# EAGLE design RoboCore Light sensor bar (EAGLE 9.6.2)
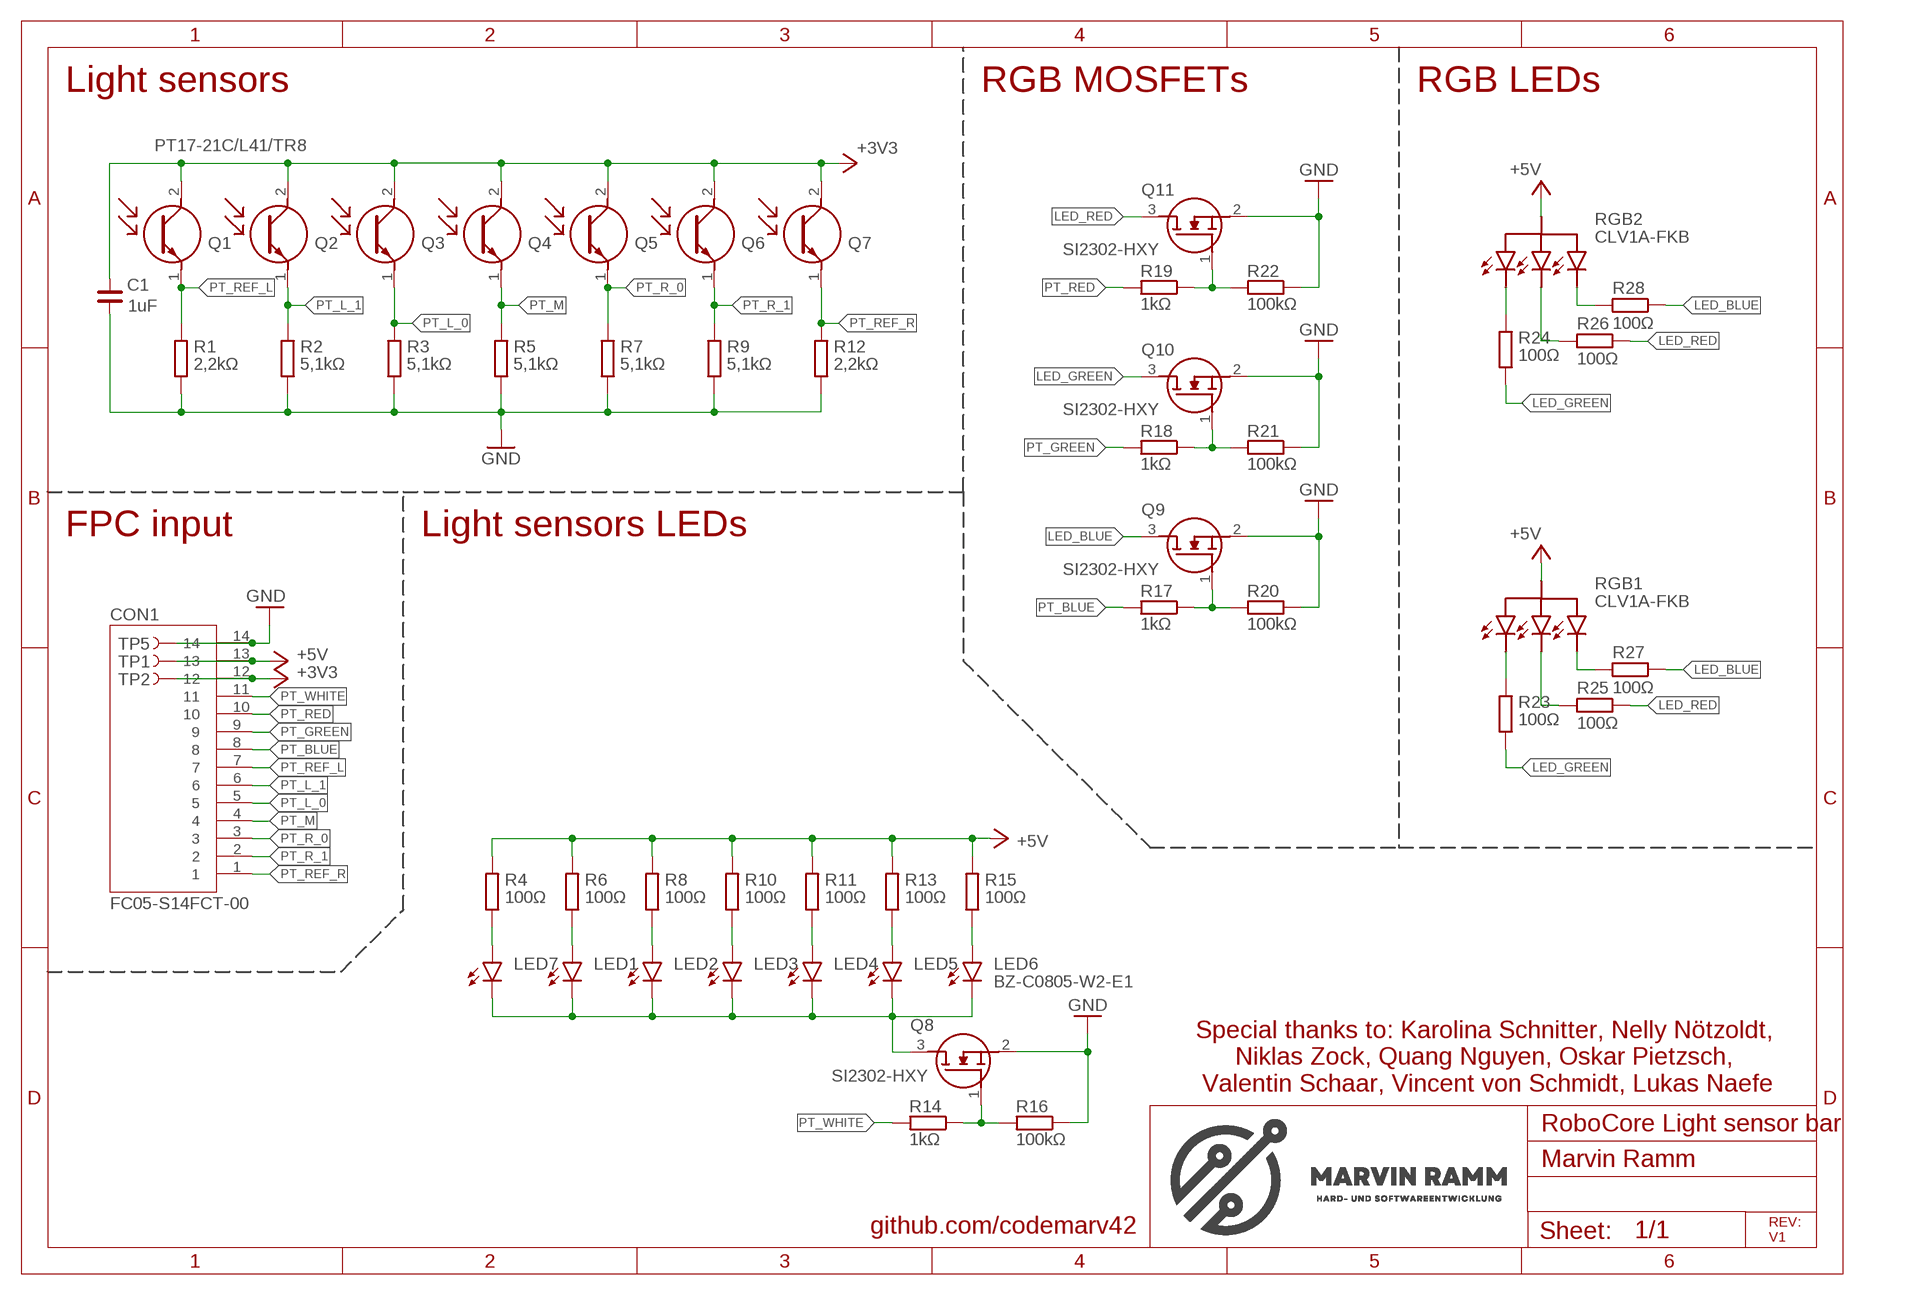
[diagram p0: schematic, sheet 1]

## Parts
C1  1uF  C_0402  [C0402]
CON1  FC05-S14FCT-00  [FC05-S14FCT-00]
LED1  LEDCHIP-LED0805  [CHIP-LED0805]
LED2  LEDCHIP-LED0805  [CHIP-LED0805]
LED3  LEDCHIP-LED0805  [CHIP-LED0805]
LED4  LEDCHIP-LED0805  [CHIP-LED0805]
LED5  LEDCHIP-LED0805  [CHIP-LED0805]
LED6  LEDCHIP-LED0805  [CHIP-LED0805]
LED7  LEDCHIP-LED0805  [CHIP-LED0805]
Q1  PT17-21C/L41/TR8  [0805]
Q2  PT17-21C/L41/TR8  [0805]
Q3  PT17-21C/L41/TR8  [0805]
Q4  PT17-21C/L41/TR8  [0805]
Q5  PT17-21C/L41/TR8  [0805]
Q6  PT17-21C/L41/TR8  [0805]
Q7  PT17-21C/L41/TR8  [0805]
Q8  SI2302DDS-T1-GE3  [SOT95P237X112-3N]
Q9  SI2302DDS-T1-GE3  [SOT95P237X112-3N]
Q10  SI2302DDS-T1-GE3  [SOT95P237X112-3N]
Q11  SI2302DDS-T1-GE3  [SOT95P237X112-3N]
R1  2,2kΩ  R_0402  [R0402]
R2  5,1kΩ  R_0402  [R0402]
R3  5,1kΩ  R_0402  [R0402]
R4  100Ω  R_0402  [R0402]
R5  5,1kΩ  R_0402  [R0402]
R6  100Ω  R_0402  [R0402]
R7  5,1kΩ  R_0402  [R0402]
R8  100Ω  R_0402  [R0402]
R9  5,1kΩ  R_0402  [R0402]
R10  100Ω  R_0402  [R0402]
R11  100Ω  R_0402  [R0402]
R12  2,2kΩ  R_0402  [R0402]
R13  100Ω  R_0402  [R0402]
R14  1kΩ  R_0402  [R0402]
R15  100Ω  R_0402  [R0402]
R16  100kΩ  R_0402  [R0402]
R17  1kΩ  R_0402  [R0402]
R18  1kΩ  R_0402  [R0402]
R19  1kΩ  R_0402  [R0402]
R20  100kΩ  R_0402  [R0402]
R21  100kΩ  R_0402  [R0402]
R22  100kΩ  R_0402  [R0402]
R23  100Ω  R_0402  [R0402]
R24  100Ω  R_0402  [R0402]
R25  100Ω  R_0402  [R0402]
R26  100Ω  R_0402  [R0402]
R27  100Ω  R_0402  [R0402]
R28  100Ω  R_0402  [R0402]
RGB1  RGBLED  [RGBLED]
RGB2  RGBLED  [RGBLED]
TP1  TEST-POINT3X5  [PAD.03X.05]
TP2  TEST-POINT3X5  [PAD.03X.05]
TP5  TEST-POINT3X5  [PAD.03X.05]

## Nets
+3V3: C1.2 CON1.12 Q1.2(C) Q2.2(C) Q3.2(C) Q4.2(C) Q5.2(C) Q6.2(C) Q7.2(C) TP2.1
+5V: CON1.13 R4.1 R6.1 R8.1 R10.1 R11.1 R13.1 R15.1 RGB1.+5V RGB2.+5V TP1.1
GND: C1.1 CON1.14 Q8.2(S) Q9.2(S) Q10.2(S) Q11.2(S) R1.2 R2.2 R3.2 R5.2 R7.2 R9.2 R12.2 R16.2 R20.2 R21.2 R22.2 TP5.1
LED_BLUE: Q9.3(D) R27.2 R28.2
LED_GREEN: Q10.3(D) R23.2 R24.2
LED_RED: Q11.3(D) R25.2 R26.2
N$1: LED1.C LED2.C LED3.C LED4.C LED5.C LED6.C LED7.C Q8.3(D)
N$2: LED7.A R4.2
N$3: Q11.1(G) R19.2 R22.1
N$4: Q10.1(G) R18.2 R21.1
N$5: Q9.1(G) R17.2 R20.1
N$14: LED5.A R13.2
N$15: LED6.A R15.2
N$17: Q8.1(G) R14.2 R16.1
N$18: LED4.A R11.2
N$45: R24.1 RGB2.P3
N$46: R28.1 RGB2.P1
N$47: R26.1 RGB2.P2
N$50: R23.1 RGB1.P3
N$51: R27.1 RGB1.P1
N$52: R25.1 RGB1.P2
N$53: LED3.A R10.2
N$54: LED2.A R8.2
N$55: LED1.A R6.2
PT_BLUE: CON1.8 R17.1
PT_GREEN: CON1.9 R18.1
PT_L_0: CON1.5 Q3.1(E) R3.1
PT_L_1: CON1.6 Q2.1(E) R2.1
PT_M: CON1.4 Q4.1(E) R5.1
PT_R_0: CON1.3 Q5.1(E) R7.1
PT_R_1: CON1.2 Q6.1(E) R9.1
PT_RED: CON1.10 R19.1
PT_REF_L: CON1.7 Q1.1(E) R1.1
PT_REF_R: CON1.1 Q7.1(E) R12.1
PT_WHITE: CON1.11 R14.1

## Notes on the sheet
- Light sensors | RGB MOSFETs | RGB LEDs
- RGB2
- SI2302-HXY | CLV1A-FKB
- SI2302-HXY
- FPC input | Light sensors LEDs
- SI2302-HXY
- RGB1
- CLV1A-FKB
- BZ-C0805-W2-E1
- Special thanks to: Karolina Schnitter, Nelly Nötzoldt, 
  Niklas Zock, Quang Nguyen, Oskar Pietzsch, 
  Valentin Schaar, Vincent von Schmidt, Lukas Naefe
- SI2302-HXY
- Marvin Ramm
- github.com/codemarv42
- REV:
  V1

## Library data of the parts
C1 = rc-master-smd:C_: NON-POLARIZED CAP
CON1 = FC05-S14FCT-00:FC05-S14FCT-00
LED1-LED7 = Led:LED: LED OSRAM: - CHIPLED LG R971, LG N971, LY N971, LG Q971, LY Q971, LO R971, LY R971 LH N974, LH R974 LS Q976, LO Q976, LY Q976 LO Q996 - Hyper CHIPLED LW Q18S LB Q993, LB Q99A, LB R99A - SideLED LS A670, LO A670, LY A670, LG A670, LP A670 LB A673, LV A673, LT A673, LW A673 LH A674 LY A675 LS A676, LA A676, LO A676, LY A676, LW A676 LS A679, LY A679, LG A679 - Hyper Micro SIDELED® LS Y876, LA Y876, LO Y876, LY Y876 LT Y87S - SmartLED LW L88C, LW L88S LB L89C, LB L89S, LG L890 LS L89K, LO L89K, LY L89K LS L896, LA L896, LO L896, LY L896 - TOPLED LS T670, LO T670, LY T670, LG T670, LP T670 LSG T670, LSP T670, LSY T670, LOP T670, LYG T670 LG T671, LOG T671, LSG T671 LB T673, LV T673, LT T673, LW T673 LH T674 LS T676, LA T676, LO T676, LY T676, LB T676, LH T676, LSB T676, LW T676 LB T67C, LV T67C, LT T67C, LS T67K, LO T67K, LY T67K, LW E67C LS E67B, LA E67B, LO E67B, LY E67B, LB E67C, LV E67C, LT E67C LW T67C LS T679, LY T679, LG T679 LS T770, LO T770, LY T770, LG T770, LP T770 LB T773, LV T773, LT T773, LW T773 LH T774 LS E675, LA E675, LY E675, LS T675 LS T776, LA T776, LO T776, LY T776, LB T776 LHGB T686 LT T68C, LB T68C - Hyper Mini TOPLED® LB M676 - Mini TOPLED Santana® LG M470 LS M47K, LO M47K, LY M47K Source: http://www.osram.convergy.de LUXEON: - LUMILED® LXK2-PW12-R00, LXK2-PW12-S00, LXK2-PW14-U00, LXK2-PW14-V00 LXK2-PM12-R00, LXK2-PM12-S00, LXK2-PM14-U00 LXK2-PE12-Q00, LXK2-PE12-R00, LXK2-PE12-S00, LXK2-PE14-T00, LXK2-PE14-U00 LXK2-PB12-K00, LXK2-PB12-L00, LXK2-PB12-M00, LXK2-PB14-N00, LXK2-PB14-P00, LXK2-PB14-Q00 LXK2-PR12-L00, LXK2-PR12-M00, LXK2-PR14-Q00, LXK2-PR14-R00 LXK2-PD12-Q00, LXK2-PD12-R00, LXK2-PD12-S00 LXK2-PH12-R00, LXK2-PH12-S00 LXK2-PL12-P00, LXK2-PL12-Q00, LXK2-PL12-R00 Source: www.luxeon.com KINGBRIGHT: KA-3528ASYC Source: www.kingbright.com
Q1-Q7 = Eigene Library:PT17-21C/L41/TR8
Q8-Q11 = SI2302DDS-T1-GE3:SI2302DDS-T1-GE3: SI2302DDS-T1-GE3 N-Channel MOSFET, 2.6 A, 20 V, 3-Pin SOT-363 Vishay Source: Datasheet <http://www.vishay.com/docs/63653/si2302dds.pdf>; ARROW_PART_NUMBER: SI2302DDS-T1-GE3; ARROW_PRICE-STOCK: https://www.arrow.com/en/products/si2302dds-t1-ge3/vishay; DESCRIPTION: SI2302DDS-T1-GE3 N-Channel MOSFET, 2.6 A, 20 V, 3-Pin SOT-363 Vishay; HEIGHT: 1.12mm; MANUFACTURER_NAME: Vishay; MANUFACTURER_PART_NUMBER: SI2302DDS-T1-GE3; MOUSER_PART_NUMBER: 78-SI2302DDS-T1-GE3; MOUSER_PRICE-STOCK: https://www.mouser.co.uk/ProductDetail/Vishay-Semiconductors/SI2302DDS-T1-GE3?qs=MxnWX8BLHKdaCSNWhg%252BxLA%3D%3D
R1-R28 = rc-master-smd:R_: RESISTOR
RGB1 RGB2 = RGB LED:RGBLED
TP1 TP2 TP5 = SparkFun-Connectors:TEST-POINT: SparkFun Test Points Bare copper test points for troubleshooting or In-Circuit-Testing. These are used by our Production team for verifying production board runs using pogo-pins on test beds. SparkFun Products: SparkFun LSM9DS1 Breakout <https://www.sparkfun.com/products/13284> SparkFun PSOC <https://www.sparkfun.com/products/13714> SparkFun Load Cell Amplifier <https://www.sparkfun.com/products/13879>

## Board
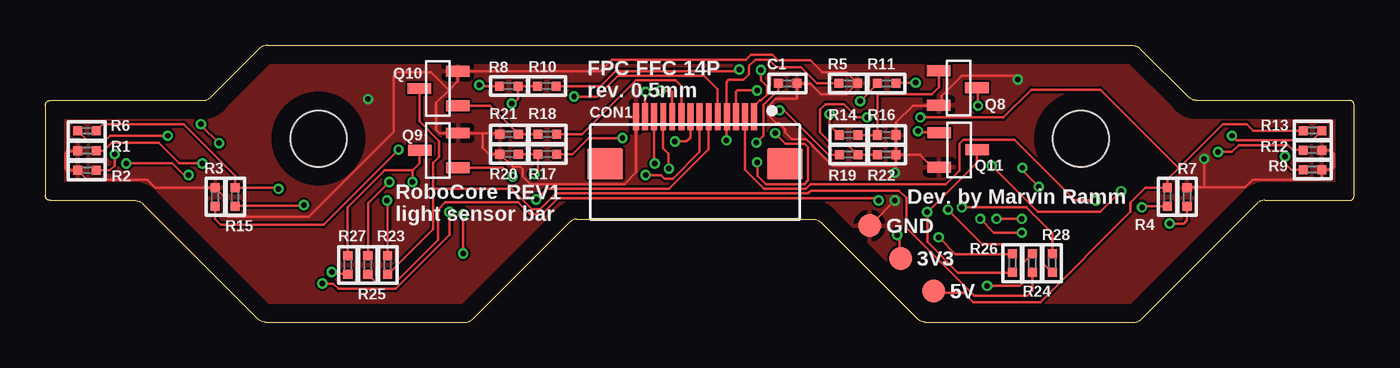
[diagram p1: board, top side]
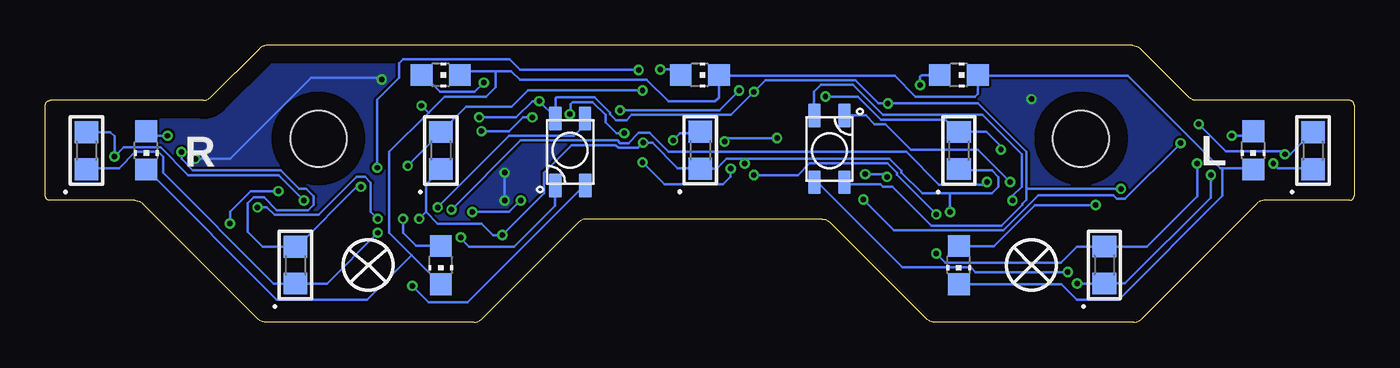
[diagram p2: board, bottom side, seen from below]

Size 72 x 15.23 mm. Coordinates in mm from the lower left corner, seen from the top.
Outline: 72,6.95 72,11.95 arc90 71.75,12.2 63.33,12.2 arc-45 62.9,12.38 60.23,15.05 arc45 59.8,15.23 12.2,15.23 arc37 11.82,15.1 9.1,12.38 arc-45 8.68,12.2 0.25,12.2 arc90 0,11.95 0,6.95 arc90 0.25,6.7 4.92,6.7 arc-45 5.35,6.52 11.7,0.17 arc45 12.12,0 23.07,0 arc45 23.5,0.17 28.82,5.5 arc-45 29.25,5.67 42.25,5.67 arc-45 42.67,5.5 48,0.17 arc45 48.42,0 59.88,0 arc45 60.3,0.17 66.65,6.52 arc-45 67.08,6.7 71.75,6.7 arc90 72,6.95
Copper layers (1*16): Top 0.035mm / dielectric 1.53mm / Bottom 0.035mm
Design rules "JLCPCB_1-2layer": minimum track width 5mil, minimum drill 0.3mm, track to track 5mil, track to pad 0.2mm, pad to pad 7mil, via to via 7mil, smd to smd 7mil, copper to edge 40mil, drill to drill 6mil, minimum pad ring 6mil, minimum via ring 0.13mm, stop-mask expansion 0.1mm, vias tented up to drill 20mil, thermal gap 10mil
Holes 3.1 mm at 15.03,10.1 56.98,10.1

### Footprints (pad centres in the part's own frame; a part is rotated, then mirrored left to right if it is on the bottom)
C0402 = smd 0.5 x 0.5: 1 -0.508,0; 2 0.508,0
FC05-S14FCT-00 = smd 0.32 x 1.5: 1 2.51,-0.45; 2 3.01,-0.45; 3 3.51,-0.45; 4 4.01,-0.45; 5 4.51,-0.45; 6 5.01,-0.45; 7 5.51,-0.45; 8 6.01,-0.45; 9 6.51,-0.45; 10 7.01,-0.45; 11 7.51,-0.45; 12 8.01,-0.45; 13 8.51,-0.45; 14 9.01,-0.45 | smd 2 x 1.7: PAD1 0.81,2.15; PAD2 10.71,2.15
CHIP-LED0805 = smd 1.2 x 1.2: A 0,-1.05; C 0,1.05
0805 = smd 1.2 x 1.3: 1 -1.016,0; 2 1.016,0
SOT95P237X112-3N = smd 1.3 x 0.6: 1 -1.05,0.95; 2 -1.05,-0.95; 3 1.05,0
R0402 = smd 0.5 x 0.5: 1 -0.508,0; 2 0.508,0
RGBLED = smd 0.686 x 1.3: +5V -1.456,1.996; P1 0.184,1.996; P2 -1.458,-1.678; P3 0.192,-1.678
PAD.03X.05 = smd 1.27 x 1.27: 1 0,0

### Placement (x,y rotation side)
C1  40.83,13.14 180 top
CON1  41.5,10.86 180 top
LED1  5.55,9.45 180 bottom
LED2  21.75,13.6 270 bottom
LED3  36,13.6 270 bottom
LED4  50.25,13.6 270 bottom
LED5  66.45,9.45 180 bottom
LED6  21.75,3.15 180 bottom
LED7  50.25,3.15 180 bottom
Q1  13.74,3.15 270 bottom
Q2  2.27,9.44 270 bottom
Q3  21.75,9.45 270 bottom
Q4  35.97,9.46 270 bottom
Q5  50.24,9.45 270 bottom
Q6  69.75,9.44 270 bottom
Q7  58.24,3.14 270 bottom
Q8  50.2,12.89 0 top
Q9  21.64,9.46 180 top
Q10  21.63,12.86 180 top
Q11  50.22,9.48 0 top
R1  2.28,9.44 180 top
R2  2.28,8.36 180 top
R3  9.34,6.9 90 top
R4  61.73,6.9 270 top
R5  44.16,13.14 0 top
R6  2.28,10.53 180 top
R7  62.81,6.9 90 top
R8  25.5,12.99 180 top
R9  69.72,8.4 0 top
R10  27.59,12.99 0 top
R11  46.28,13.14 0 top
R12  69.72,9.47 0 top
R13  69.72,10.54 0 top
R14  44.19,10.3 0 top
R15  10.44,6.9 270 top
R16  46.29,10.3 0 top
R17  27.62,9.25 180 top
R18  27.62,10.34 180 top
R19  44.19,9.22 0 top
R20  25.51,9.25 180 top
R21  25.51,10.34 180 top
R22  46.29,9.22 0 top
R23  18.83,3.15 270 top
R24  54.29,3.25 270 top
R25  17.74,3.15 270 top
R26  53.2,3.25 270 top
R27  16.64,3.15 90 top
R28  55.39,3.25 270 top
RGB1  29.5,9.7 180 bottom
RGB2  42.49,9.2 0 bottom
TP1  48.86,1.71 315 top
TP2  47.06,3.51 315 top
TP5  45.35,5.32 135 top

### Tracks (layer width: path | path; a pad name or v marks a point on that pad's centre or on a via)
+3V3  (via drill 0.3)
  Top 0.127: v4.45,8.73 6.99,8.73 7.62,8.1 v7.87,8.1 | v46.86,4.8 46.99,4.67 46.99,3.53 TP2.1 | v39.12,9.88 39.5,10.26 39.5,11.97 40.32,12.79 C1.2 | v33.53,8.73 33.49,8.77 CON1.12 | v15.24,2.13 15.84,2.13 16.13,1.83 19.25,1.83 22.23,4.8 v22.23,6.06 | v53.72,4.92 52.2,4.92 v51.44,5.69
  Bottom 0.127: Q6.2 69.72,8.48 67.94,8.48 67.06,9.37 65.79,9.37 65.53,9.11 65.53,8.23 59.44,2.13 58.29,2.13 Q7.2 58.17,2.13 56.52,2.13 v53.72,4.92 | v4.45,8.73 4.19,8.48 2.29,8.48 Q2.2 | v7.87,8.1 7.87,6.86 12.6,2.13 Q1.2 13.84,2.13 v15.24,2.13 | 51.05,6.07 50.42,5.43 48.01,5.43 47.37,4.8 v46.86,4.8 44.58,7.08 44.58,8.23 43.05,9.75 40.63,9.75 40.48,9.6 39.39,9.6 v39.12,9.88 38.61,9.88 37.21,8.48 36.01,8.48 Q4.2 35.09,8.44 34.54,8.99 34.08,8.99 34.07,8.99 33.53,8.99 | 51.05,6.07 51.05,7.59 50.29,8.35 Q5.2 | 22.23,7.08 23.75,7.08 24.9,8.24 24.9,8.33 25.56,8.99 33.53,8.99 | 22.23,7.08 19.94,7.08 19.56,7.46 19.56,7.97 19.94,8.35 21.72,8.35 Q3.2 | 33.53,8.99 v33.53,8.73 | 22.23,7.08 v22.23,6.06 | 51.05,6.07 v51.44,5.69
+5V  (via drill 0.3)
  Top 0.127: 62.36,8.48 64.77,10.89 66.1,10.89 66.45,10.54 R13.1 | 62.36,8.48 61.74,7.86 R4.1 60.52,7.41 59.69,6.58 59.69,6.07 54.74,1.11 51.05,1.11 50.55,1.62 48.9,1.62 TP1.1 | R6.1 3.15,10.89 7.61,10.89 10.44,8.05 R15.1 10.46,7.4 12.77,7.4 v12.83,7.34 | R10.1 R8.1 26.01,12.29 25.75,12.04 v25.65,12.04 | v44.83,12.16 45.72,13.05 R11.1 | v33.02,12.67 33,12.65 33,11.34 CON1.13 | 62.36,8.48 58.04,12.8 54.24,12.8 52.71,11.27 v48.13,11.27
  Bottom 0.127: 43.94,11.27 v44.83,12.16 45.21,12.16 46.1,11.27 v48.13,11.27 | 43.94,11.27 RGB2.+5V | 18.03,7.34 18.03,9.37 20.7,12.04 v25.65,12.04 26.16,12.04 27.43,13.31 32.38,13.31 v33.02,12.67 34.29,11.4 39.75,11.4 40.04,11.11 40.61,11.11 40.93,11.43 40.93,11.51 41.79,12.37 43.89,12.37 43.94,12.32 43.94,11.28 43.94,11.27 | RGB1.+5V 27.94,7.59 26.06,7.59 25.93,7.46 25.39,7.46 23.25,5.32 19.41,5.32 18.25,6.48 18.25,6.51 18.03,6.73 18.03,7.34 | 18.03,7.34 v12.83,7.34
GND  (via drill 0.3)
  Top 0.127: 63.75,7.41 65.99,7.41 66.42,7.84 70.11,7.84 70.23,7.97 R9.2 70.77,8.4 70.92,8.55 70.92,9.28 70.73,9.47 R12.2 70.23,9.37 | 63.75,7.41 R7.2 | R5.2 44.58,13.05 44.07,12.54 42.67,12.54 42.08,13.13 C1.1 41.34,12.32 41.32,12.29 40.18,12.29 39.75,11.86 39.75,11.4 40.21,10.94 40.38,10.94 40.69,10.62 40.69,10.46 41.08,10.08 41.85,10.08 42.21,9.73 42.21,9.71 43.31,8.61 46.8,8.61 | R22.2 R16.2 46.8,10.99 47.72,11.91 49.15,11.91 Q8.2 49.34,12.08 49.34,12.47 50.43,13.56 53.29,13.56 v53.5,13.35 | Q11.2 48.8,8.53 48.11,9.21 R22.2 | v46.74,6.7 45.47,5.43 TP5.1 | 46.8,8.61 R22.2 | 46.8,8.61 46.8,8.29 v46.74,8.23 | v63.75,8.99 63.75,7.41 | 1.78,8.48 R2.2 | 1.78,9.37 1.78,9.38 | 1.78,9.38 R1.2 | R2.2 2.29,7.84 5.59,7.84 6.04,7.39 9.33,7.39 R3.2 9.4,7.34 9.91,6.83 9.91,5.94 10.03,5.81 14.48,5.81 19.15,10.48 19.15,13.53 19.37,13.75 21.22,13.75 22.2,12.77 | 25.02,9.37 R20.2 | 25.02,10.26 R21.2 24.89,10.39 24.06,10.39 | 24.06,10.39 22.73,10.39 Q9.2 21.68,10.41 21.51,10.58 21.51,12.08 22.2,12.77 | 22.2,12.77 22.68,13.25 Q10.2 30.52,13.81 31.16,14.45 38.55,14.45 38.81,14.71 39.99,14.71 40.3,14.4 42.1,14.4 42.75,13.75 44.06,13.75 R5.2 | 44.58,13.18 R5.2 | R20.2 25.72,8.54 26.11,8.54 26.24,8.41 26.24,8.04 26.68,7.6 31.85,7.6 32.49,8.24 CON1.14 | R20.2 24.41,9.25 24.06,9.6 24.06,10.39 | 1.78,9.38 1.74,9.41 1.2,9.41 1.08,9.29 1.08,8.44 1.16,8.36 R2.2
  Bottom 0.127: v46.74,8.23 v46.74,6.7 | v63.75,8.99 61.85,8.99 57.38,13.45 53.6,13.45 v53.5,13.35
  other vias: 17.75,12.27
  pour Top: 0,11.94 0,15.22 12.77,15.22 72,15.22 72,10.48 72,0 53.21,0 0,0 0,11.93
  pour Bottom: 0,11.84 0,15.23 12.89,15.23 72,15.23 72,9.23 72,0 55.9,0 0,0 0,11.83
LED_BLUE  (via drill 0.3)
  Top 0.127: v49.66,6.19 51.56,4.29 54.74,4.29 54.86,4.16 54.86,3.27 55.37,2.76 R28.2 | 20.19,8.35 18.67,8.35 16.63,6.32 R27.2 | 20.19,8.35 v20.19,7.72 | 20.19,8.35 20.59,8.75 Q9.3
  Bottom 0.127: v49.66,6.19 45.85,10 40.52,10 40.38,9.86 39.92,9.86 39.36,10.42 38.77,10.42 37.72,9.37 24.64,9.37 22.83,7.57 20.35,7.57 v20.19,7.72
LED_GREEN
  Top 0.127: 21.34,7.34 21.34,8.76 21.67,9.09 21.67,9.97 20.58,11.06 Q10.3 | 21.34,7.34 21.34,5.13 18.85,2.64 R23.2 | R24.2 54.29,1.72 54.03,1.46 51.11,1.46 47.37,5.2 47.37,6.84 46.96,7.25 42.12,7.25 41.96,7.09 28.11,7.09 27.23,6.21 26.77,6.21 25.64,7.34 21.34,7.34
LED_RED  (via drill 0.3)
  Top 0.127: v45.85,6.7 45.72,6.83 28.21,6.83 27.33,5.95 26.67,5.95 26.02,6.61 22,6.61 21.59,6.2 21.59,4.53 19.19,2.13 18.25,2.13 R25.2 | Q11.3 51.26,8.77 48.55,6.07 v48.51,6.07 48.51,4.42 50.2,2.73 R26.2
  Bottom 0.127: v45.85,6.7 46.48,6.07 v48.51,6.07
N$1  (via drill 0.3)
  Top 0.127: v51.31,11.91 51.31,12.8 Q8.3
  Bottom 0.127: 7.24,8.48 7.37,8.48 12.45,13.56 20.57,13.56 LED2.C 20.7,12.57 20.85,12.42 24.13,12.42 25.27,13.56 34.92,13.56 LED3.C 34.95,12.36 35.17,12.15 37.73,12.15 38.92,13.34 45.89,13.34 46.37,13.81 47.24,13.81 | 7.24,8.48 5.59,8.48 LED1.C | 7.24,8.48 7.24,6.96 12.95,1.24 15.24,1.24 16.09,2.09 LED6.C | LED7.C 50.26,2.1 51.85,3.69 | 50.93,11.53 50.04,12.42 47.75,12.42 47.24,12.93 47.24,13.81 | 50.93,11.53 53.09,9.37 53.09,4.92 51.85,3.69 | LED5.C 66.42,8.35 66.39,8.35 59.27,1.24 54.3,1.24 51.85,3.69 | 50.93,11.53 v51.31,11.91 | 47.24,13.81 48.99,13.81 LED4.C
N$2  (via drill 0.3)
  Top 0.127: v60.33,6.32 60.4,6.39 R4.2 | v52.32,5.69 v53.72,5.69
  Bottom 0.127: v60.33,6.32 59.82,6.32 59.4,5.9 56.96,5.9 54.88,7.99 54.42,7.99 54.11,7.67 54.11,6.07 v53.72,5.69 | v52.32,5.69 52.32,4.93 51.61,4.21 LED7.A
N$3  (via drill 0.3)
  Top 0.127: R22.1 R19.2 44.67,9.22 44.15,9.75 43.31,9.75 42.6,10.45 42.6,11.68 42.92,11.99 43.93,11.99 44.65,11.27 v45.21,11.27 | v48.01,10.51 48.07,10.45 49.16,10.45 Q11.1
  Bottom 0.127: v45.21,11.27 45.72,11.27 46.48,10.51 v48.01,10.51
N$4
  Top 0.127: R18.2 R21.1 24.45,11.91 22.73,11.91 Q10.1
N$5  (via drill 0.3)
  Top 0.127: R20.1 26.04,9.24 27.05,9.24 R17.2 27.11,8.36 v26.9,8.15 | Q9.1 25.19,8.51 v25.7,8
  Bottom 0.127: v25.7,8 25.85,8.15 v26.9,8.15
N$14  (via drill 0.3)
  Top 0.127: R13.2 69.7,10 65.53,10 v65.28,10.26
  Bottom 0.127: v65.28,10.26 66.29,10.26 66.42,10.39 LED5.A
N$15  (via drill 0.3)
  Top 0.127: v14.22,6.45 14.17,6.4 10.45,6.4 R15.2
  Bottom 0.127: v14.22,6.45 17.56,6.45 19.82,4.19 LED6.A
N$17
  Top 0.127: R14.2 R16.1 45.78,12.5 45.82,12.54 48.77,12.54 49.15,12.92 49.15,13.81 Q8.1
N$18  (via drill 0.3)
  Top 0.127: v47.88,13.18 46.86,13.18 R11.2
  Bottom 0.127: v47.88,13.18 48.39,12.67 50.29,12.67 51.18,13.56 LED4.A
N$45  (via drill 0.3)
  Top 0.127: v51.82,2 53.62,2 53.75,2.13 53.75,3.22 R24.1
  Bottom 0.127: v51.82,2 50.93,1.11 48.77,1.11 42.42,7.46 RGB2.P3
N$46  (via drill 0.3)
  Top 0.127: R28.1 55.39,4.9 53.98,6.32 v50.42,6.32
  Bottom 0.127: v50.42,6.32 46.48,10.26 42.92,10.26 42.31,10.87 RGB2.P1
N$47  (via drill 0.3)
  Top 0.127: v49.15,4.67 50.07,3.75 53.1,3.75 53.1,3.76 R26.1
  Bottom 0.127: v49.15,4.67 49.15,4.61 48.7,4.16 46.22,4.16 43.97,6.41 43.97,7.52 RGB2.P2
N$50  (via drill 0.3)
  Top 0.127: v18.8,6.7 18.83,6.67 18.83,3.67 R23.1
  Bottom 0.127: v18.8,6.7 18.8,6.96 18.29,7.46 18.29,9.24 20.45,11.4 25.91,11.4 27.56,13.05 29.34,13.05 29.72,12.67 29.72,11.4 RGB1.P3
N$51  (via drill 0.3)
  Top 0.127: v15.75,2.76 15.84,2.67 16.64,2.67 R27.1
  Bottom 0.127: v15.75,2.76 20.83,2.76 21.08,3.02 24.86,3.02 29.43,7.59 29.59,7.59 RGB1.P1
N$52  (via drill 0.3)
  Top 0.127: R25.1 17.74,6.53 v18.92,7.72
  Bottom 0.127: v18.92,7.72 20.7,9.5 24.38,9.5 25.78,10.89 26.39,10.89 26.87,11.37 RGB1.P2
N$53  (via drill 0.3)
  Top 0.127: v38.18,13.91 38.09,13.81 31.37,13.81 30.55,12.99 R10.2
  Bottom 0.127: v38.18,13.91 37.36,13.91 LED3.A
N$54  (via drill 0.3)
  Top 0.127: R8.2 23.95,12.98 v23.88,13.05
  Bottom 0.127: v23.88,13.05 23.88,13.5 23.78,13.6 LED2.A
N$55  (via drill 0.3)
  Top 0.127: v6.73,10.26 3.56,10.26 3.3,10 2.29,10 1.78,10.51 R6.2
  Bottom 0.127: v6.73,10.26 5.71,10.26 5.59,10.39 LED1.A
PT_BLUE  (via drill 0.3)
  Top 0.127: R17.1 29.01,9.25 29.89,10.13 v31.75,10.13 | v34.64,9.94 35.28,9.94 35.49,10.16 CON1.8
  Bottom 0.127: v31.75,10.13 34.45,10.13 v34.64,9.94
PT_GREEN
  Top 0.127: R18.1 29.54,10.34 32.51,13.31 34.66,13.31 34.99,12.97 CON1.9
PT_L_0  (via drill 0.3)
  Top 0.127: R3.1 9.34,5.67 9.65,5.36 15.29,5.36 v19.43,9.5 | v29.08,12.42 30.35,12.42 31.5,13.56 36.23,13.56 36.99,12.8 CON1.5
  Bottom 0.127: v19.43,9.5 19.43,9.68 20.23,10.48 21.73,10.48 Q3.1 21.84,10.51 22.48,11.15 26.04,11.15 27.3,12.42 v29.08,12.42
PT_L_1  (via drill 0.3)
  Top 0.127: R2.1 3.55,8.35 3.81,8.61 v3.81,9.24 | v27,6.75 27.59,7.34 34.32,7.34 36.49,9.51 CON1.6 | v9.55,9.85 8.55,10.85 v8.55,10.9
  Bottom 0.127: Q2.1 2.31,10.46 3.52,9.24 v3.81,9.24 3.97,9.4 7.05,9.4 v8.55,10.9 | v27,6.75 25.31,5.06 19.31,5.06 17.38,6.99 13.25,6.99 13.05,6.79 12.6,6.79 9.65,9.75 v9.55,9.85
PT_M  (via drill 0.3)
  Top 0.127: R5.1 42.46,13.14 41.56,14.04 40.21,14.04 39.8,14.45 39.07,14.45 38.72,14.1 38.72,13.64 38.41,13.33 37.58,13.33 37.47,13.21 37.47,11.4 CON1.4 37.47,11.27 v37.47,10
  Bottom 0.127: v37.47,10 37.08,10.39 36.07,10.39 Q4.1
PT_R_0  (via drill 0.3)
  Top 0.127: v61.85,5.43 62.64,5.43 62.81,5.6 R7.1 | v59.18,7.21 58.04,6.07 54.61,6.07 v52.07,8.61 | v39.15,12.75 38.07,12.75 37.99,12.67 CON1.3
  Bottom 0.127: v61.85,5.43 61.85,6.07 60.71,7.21 v59.18,7.21 | v52.07,8.61 50.29,10.39 Q5.1 48.86,11.85 46.35,11.85 45.45,12.75 v39.15,12.75
PT_R_1  (via drill 0.3)
  Top 0.127: R9.1 68.54,8.39 68.2,8.73 v68.2,9.11 | v57.78,6.7 56.64,6.7 53.3,10.04 50.51,10.04 50.29,9.82 50.29,8.33 49.55,7.59 42.1,7.59 41.85,7.34 39.52,7.34 38.49,8.38 CON1.2
  Bottom 0.127: Q6.1 68.43,10.46 68.2,10.22 v68.2,9.11 67.69,9.62 65.66,9.62 64.14,8.1 59.18,8.1 v57.78,6.7
PT_RED  (via drill 0.3)
  Top 0.127: v40.39,11.66 40.64,11.66 43.07,9.22 R19.1 | v33.84,12.74 34.41,12.74 34.49,12.67 CON1.10
  Bottom 0.127: v40.39,11.66 34.92,11.66 v33.84,12.74
PT_REF_L  (via drill 0.3)
  Top 0.127: v8.64,8.73 7.37,8.73 6.22,9.88 3.64,9.88 3.21,9.45 R1.1 | v22.99,3.78 v22.99,5.94 | v33.02,8.1 33.88,8.1 34.08,7.91 34.52,7.91 35.99,9.37 CON1.7
  Bottom 0.127: v8.64,8.73 8.64,6.94 11.41,4.17 Q1.1 13.84,4.16 15.24,4.16 16.13,3.27 22.48,3.27 v22.99,3.78 | v33.02,8.1 30.61,8.1 29.97,8.73 25.66,8.73 25.16,8.23 25.16,8.11 v22.99,5.94
PT_REF_R  (via drill 0.3)
  Top 0.127: v64.52,9.37 65.28,9.37 65.66,9.75 68.36,9.75 68.64,9.48 69.18,9.48 R12.1 | v54.65,7.45 53.75,8.35 v53.75,8.5 | v39.37,13.88 39.37,13.3 39.69,12.98 39.69,12.52 39.38,12.21 39.33,12.21 38.99,11.87 CON1.1
  Bottom 0.127: v54.65,7.45 54.87,7.45 58.16,4.16 Q7.1 60.05,4.16 60.87,4.98 60.87,6.55 60.55,6.86 59.98,6.86 59.27,6.16 57.56,6.16 57.24,6.48 57.24,6.93 57.65,7.34 58.04,7.34 59.05,8.35 63.89,8.35 64.52,8.98 v64.52,9.37 | v53.75,8.5 53.75,12.25 52.55,13.45 52.55,14.25 52.33,14.47 46.48,14.47 45.88,13.88 v39.37,13.88
PT_WHITE  (via drill 0.3)
  Top 0.127: CON1.11 33.99,9.56 34.28,9.27 34.28,8.47 v34.3,8.45 | R14.1 43.15,10.84 v43.15,11.45 | v40.15,10.4 40.73,9.82 41.75,9.82 41.95,9.62 41.95,7.8 41.75,7.6 39.63,7.6 39.17,8.06 39.17,8.78 v39.15,8.8
  Bottom 0.127: v34.3,8.45 34.3,7.99 34.71,7.58 37.93,7.58 v39.15,8.8 | v43.15,11.45 43.12,11.47 43.12,11.99 43,12.11 41.89,12.11 41.18,11.41 41.18,11 40.58,10.4 v40.15,10.4

### Text on the board
tPlace: FPC FFC 14P / rev. 0,5mm | REV1 | Dev. by Marvin Ramm | RoboCore / light sensor bar | GND | 3V3 | 5V
bPlace: L | R